# Altium schematic sheet Connectors.SchDoc
size A4; CompanyName: Technische Hochschule Nürnberg Georg Simon Ohm; Organization: UltraZohm; Address1: Kesslerplatz 12; Address2: 90489 Nürnberg; Address3: GERMANY; Website: www.ultrazohm.com
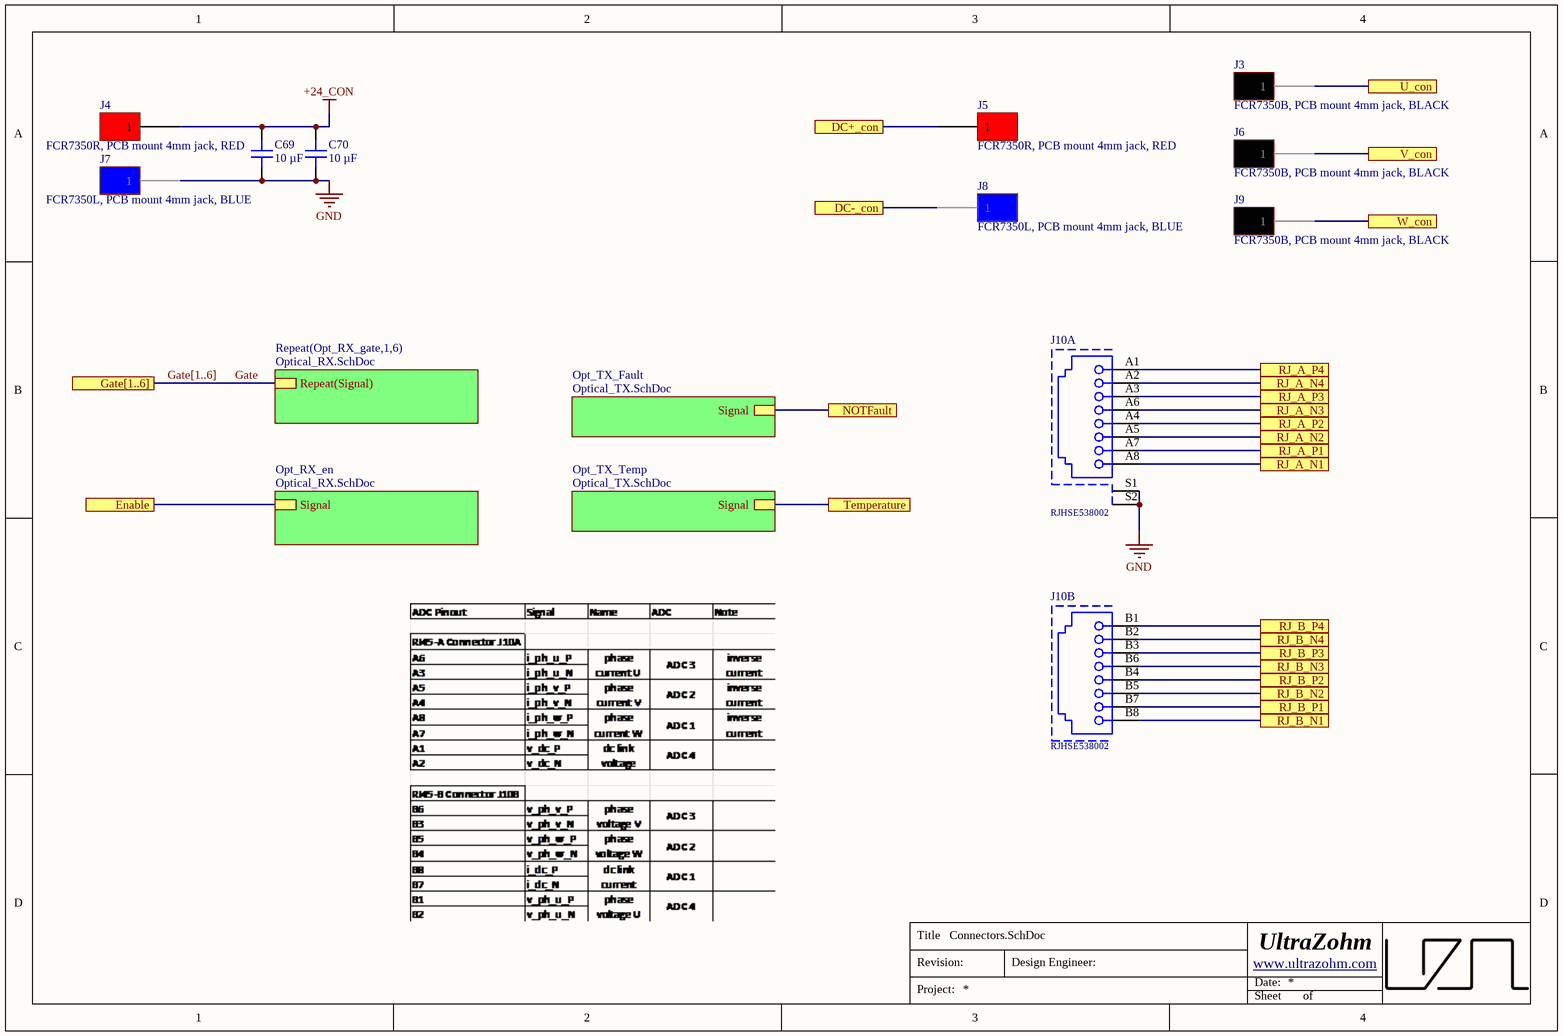
[diagram p0: Connectors.SchDoc]

## Parts
C69  10 µF  [C_1206]
C70  10 µF  [C_1206]
J3  FCR7350B, PCB mount 4mm jack, BLACK  [FCR7350]
J4  FCR7350R, PCB mount 4mm jack, RED  [FCR7350]
J5  FCR7350R, PCB mount 4mm jack, RED  [FCR7350]
J6  FCR7350B, PCB mount 4mm jack, BLACK  [FCR7350]
J7  FCR7350L, PCB mount 4mm jack, BLUE  [FCR7350]
J8  FCR7350L, PCB mount 4mm jack, BLUE  [FCR7350]
J9  FCR7350B, PCB mount 4mm jack, BLACK  [FCR7350]
J10  RJHSE538002  [RJHSE-5380-02]  (parts A,B of 2)

## Sub-sheets
Opt_RX_en = Optical_RX.SchDoc: Signal
Opt_TX_Fault = Optical_TX.SchDoc: Signal
Opt_TX_Temp = Optical_TX.SchDoc: Signal
Repeat(Opt_RX_gate,1,6) = Optical_RX.SchDoc: Repeat(Signal)

## Ports
DC+_con, DC-_con, Enable, Gate[1..6], NOTFault, RJ_A_N1, RJ_A_N2, RJ_A_N3, RJ_A_N4, RJ_A_P1, RJ_A_P2, RJ_A_P3, RJ_A_P4, RJ_B_N1, RJ_B_N2, RJ_B_N3, RJ_B_N4, RJ_B_P1, RJ_B_P2, RJ_B_P3, RJ_B_P4, Temperature, U_con, V_con, W_con

## Nets
+24_CON: C69.2 C70.2 J4.1
GND: C69.1 C70.1 J7.1 J10.S1 J10.S2
DC+_con: J5.1 ; port DC+_con
DC-_con: J8.1 ; port DC-_con
Enable: port Enable, sheet Opt_RX_en/Signal
Gate: sheet Repeat(Opt_RX_gate,1,6)/Repeat(Signal)
NOTFault: port NOTFault, sheet Opt_TX_Fault/Signal
RJ_A_N1: J10.A8 ; port RJ_A_N1
RJ_A_N2: J10.A5 ; port RJ_A_N2
RJ_A_N3: J10.A6 ; port RJ_A_N3
RJ_A_N4: J10.A2 ; port RJ_A_N4
RJ_A_P1: J10.A7 ; port RJ_A_P1
RJ_A_P2: J10.A4 ; port RJ_A_P2
RJ_A_P3: J10.A3 ; port RJ_A_P3
RJ_A_P4: J10.A1 ; port RJ_A_P4
RJ_B_N1: J10.B8 ; port RJ_B_N1
RJ_B_N2: J10.B5 ; port RJ_B_N2
RJ_B_N3: J10.B6 ; port RJ_B_N3
RJ_B_N4: J10.B2 ; port RJ_B_N4
RJ_B_P1: J10.B7 ; port RJ_B_P1
RJ_B_P2: J10.B4 ; port RJ_B_P2
RJ_B_P3: J10.B3 ; port RJ_B_P3
RJ_B_P4: J10.B1 ; port RJ_B_P4
Temperature: port Temperature, sheet Opt_TX_Temp/Signal
U_con: J3.1 ; port U_con
V_con: J6.1 ; port V_con
W_con: J9.1 ; port W_con

## Buses and harness runs
bus Gate[1..6] = port Gate[1..6]

## Notes on the sheet
- Title
- Revision:
- Design Engineer:
- Date:
- Project:
- Sheet
- of

## Library data of the parts
C69 C70 = CGA5L1X7R1H106K160AC: Capacitor 1206, 50 VDC, 10 µF, X7R; Manufacturer: TDK; Tolerance: 10 %; Voltage Rating: 50 VDC; Created from: MGremer; Manufacturer Part Number: CGA5L1X7R1H106K160AC; PartID: 25; Created On: 20.12.2020 13:54:13; ComponentLink1Description: Datasheet; ComponentLink1URL: https://product.tdk.com/info/en/catalog/datasheets/mlcc_automotive_general_en.pdf; Component Type: Capacitor 1206; Device Package: 1206; Last Updated: 27.05.2022 14:15:21; Mounting Type: SMD; Operating Temperature: -55 - 125°C; Series: CGA; Supplier 1: Mouser; Supplier Part Number 1: 810-CGA5L1X7R1H106K1; Type: Capacitor; Value: 10 µF; Live Cycle Status: 1; LCSC Part Number: C13585; Stock number: Labor SMD Container
J3 J6 J9 = FCR7350B: FCR7350B, 1000V, 24A, BLACK; Manufacturer: Cliff; Value: PCB mount 4mm jack, Black	FCR7350B, 1000V, 24A; Created from: DHufnagel; Manufacturer Part Number: FCR7350B; PartID: 6; Created On: 13.06.2022 10:18:11; ComponentLink1Description: datasheet; ComponentLink1URL: https://www.cliffuk.co.uk/products/testleads/sockets/S16NPC.pdf; ComponentLink2Description: drawing; ComponentLink2URL: https://media.digikey.com/pdf/Data%20Sheets/Cliff%20Electronic%20LTD%20PDF's/FCR7350_Drawing.pdf; Component Type: PCB mount 4mm jack, Black; Device Package: THT; Last Updated: 28.06.2022 13:58:37; Minimum Order: 1; Mounting Type: THT; Operating Temperature: -40°C - 80°C; Series: S16N-PC; Supplier 1: Digi-Key; Supplier Part Number 1: 3185-FCR7350B-ND; Supplier 2: farnell; Supplier Part Number 2: 1854507; Type: PCB mount 4mm jack, Black	FCR7350B, 1000V, 24A; Live Cycle Status: 1; Stock number: not stored
J4 J5 = FCR7350R: FCR7350B, 1000V, 24A, RED; Manufacturer: Cliff; Value: PCB mount 4mm jack, Red FCR7350R, 1000V, 24A; Created from: DHufnagel; Manufacturer Part Number: FCR7350R; PartID: 7; Created On: 13.06.2022 10:18:11; ComponentLink1Description: datasheet; ComponentLink1URL: https://www.cliffuk.co.uk/products/testleads/sockets/S16NPC.pdf; ComponentLink2Description: drawing; ComponentLink2URL: https://media.digikey.com/pdf/Data%20Sheets/Cliff%20Electronic%20LTD%20PDF's/FCR7350_Drawing.pdf; Component Type: PCB mount 4mm jack, Red; Device Package: THT; Last Updated: 28.06.2022 13:58:37; Minimum Order: 1; Mounting Type: THT; Operating Temperature: -40°C - 80°C; Series: S16N-PC; Supplier 1: Digi-Key; Supplier Part Number 1: 3185-FCR7350R-ND; Supplier 2: farnell; Supplier Part Number 2: 1854508; Type: PCB mount 4mm jack, Red FCR7350R, 1000V, 24A; Live Cycle Status: 1; Stock number: not stored
J7 J8 = FCR7350L: FCR7350B, 1000V, 24A, BLUE; Manufacturer: Cliff; Value: PCB mount 4mm jack, Blue FCR7350L, 1000V, 24A; Created from: DHufnagel; Manufacturer Part Number: FCR7350L; PartID: 8; Created On: 13.06.2022 10:18:11; ComponentLink1Description: datasheet; ComponentLink1URL: https://www.cliffuk.co.uk/products/testleads/sockets/S16NPC.pdf; ComponentLink2Description: drawing; ComponentLink2URL: https://media.digikey.com/pdf/Data%20Sheets/Cliff%20Electronic%20LTD%20PDF's/FCR7350_Drawing.pdf; Component Type: PCB mount 4mm jack, Blue; Device Package: THT; Last Updated: 28.06.2022 13:58:37; Minimum Order: 1; Mounting Type: THT; Operating Temperature: -40°C - 80°C; Series: S16N-PC; Supplier 1: Digi-Key; Supplier Part Number 1: 3185-FCR7350L-ND; Supplier 2: farnell; Supplier Part Number 2: 1854511; Type: PCB mount 4mm jack, Blue FCR7350L, 1000V, 24A; Live Cycle Status: 1; Stock number: not stored
J10 = RJHSE538002: CAT5, RJ45 Connector, 1x2; Manufacturer: Amphenol; Created from: MGremer; Manufacturer Part Number: RJHSE538002; PartID: 4; Created On: 22.02.2021 16:43:38; ComponentLink1Description: Datasheet; ComponentLink1URL: https://www.farnell.com/cad/2360382.pdf; Component Type: RJ45 Connector; Device Package: RJ45; Last Updated: 22.02.2021 16:43:38; Mounting Type: THT; Series: RJHSE; Supplier 1: Farnell; Supplier Part Number 1: 1860605; Type: RJ45 Connector; Live Cycle Status: 1; Stock number: not stored